# Altium schematic sheet Electrodos.SchDoc
size A4; SheetNumber: 1; SheetTotal: 1
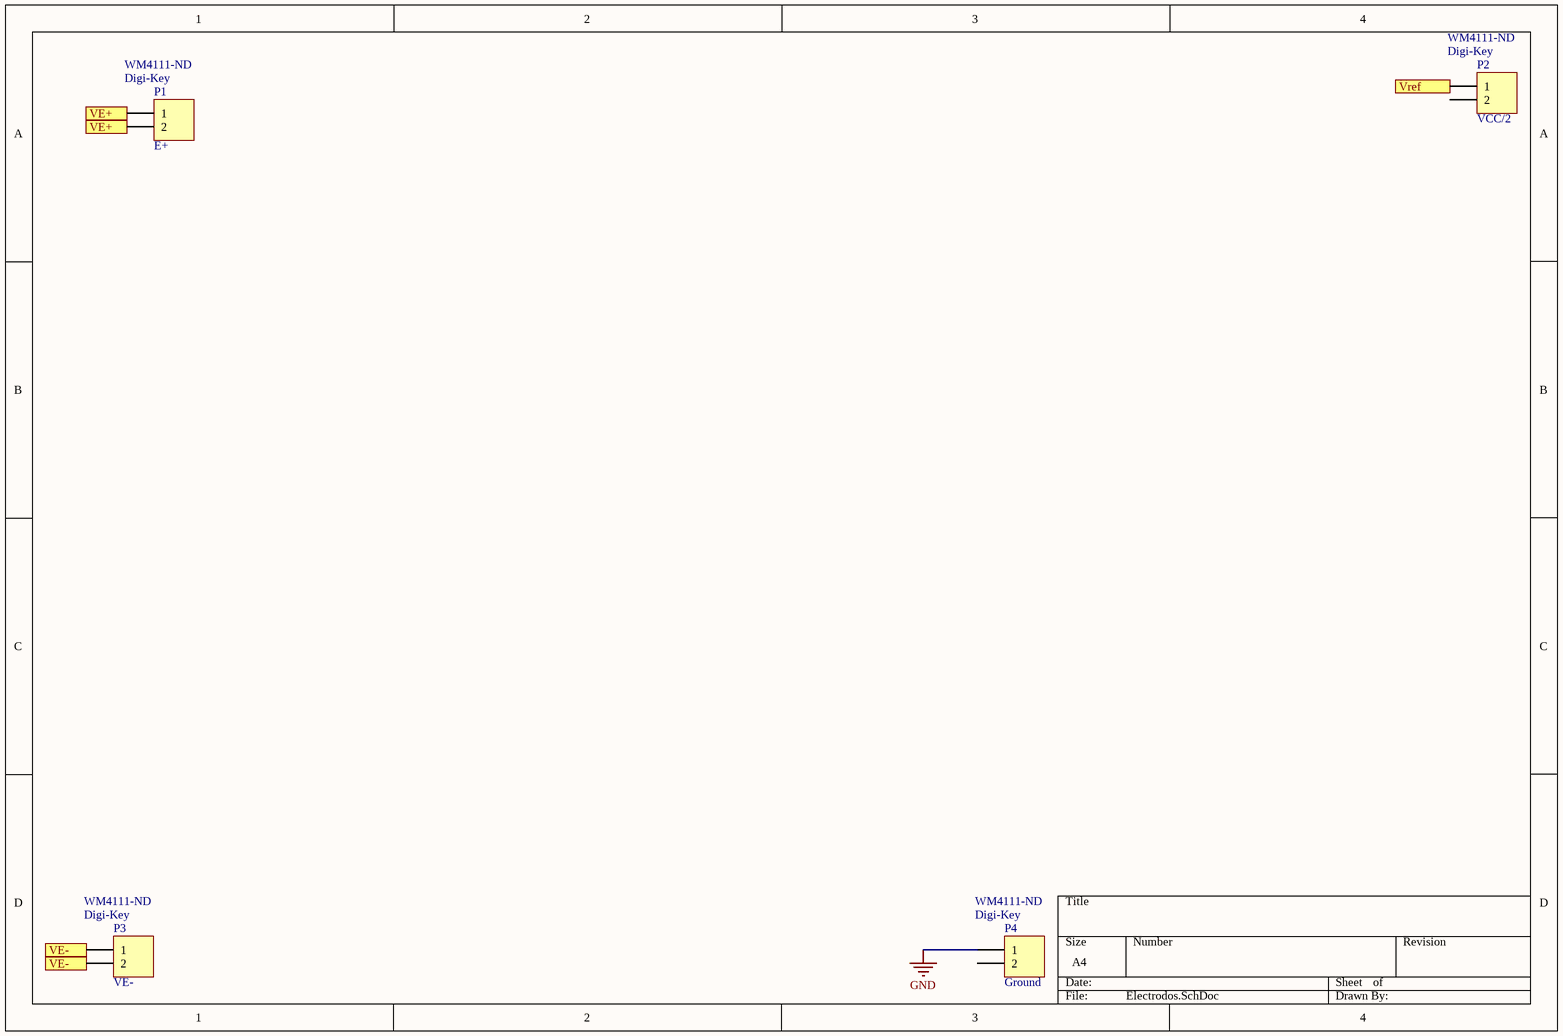
[diagram p0: Electrodos.SchDoc]

## Parts
P1  E+  Supplier 1: Digi-Key  Supplier Part Number 1: WM4111-ND  [HDR1X2]
P2  VCC/2  Supplier 1: Digi-Key  Supplier Part Number 1: WM4111-ND  [HDR1X2]
P3  VE-  Supplier 1: Digi-Key  Supplier Part Number 1: WM4111-ND  [HDR1X2]
P4  Ground  Supplier 1: Digi-Key  Supplier Part Number 1: WM4111-ND  [HDR1X2]

## Ports
VE+ (see Electrodos[1A]), VE- (see Electrodos[1D]), Vref

## Nets
GND: P4.1
VE+: P1.1 P1.2 ; port VE+
VE-: P3.1 P3.2 ; port VE-
Vref: P2.1 ; port Vref

Not connected (* = marked no-connect by the designer): P2 2; P4 2

## Library data of the parts
P1-P4 = Header 2: Header, 2-Pin; LatestRevisionDate: 17-Jul-2002; LatestRevisionNote: Re-released for DXP Platform.; Publisher: Altium Limited